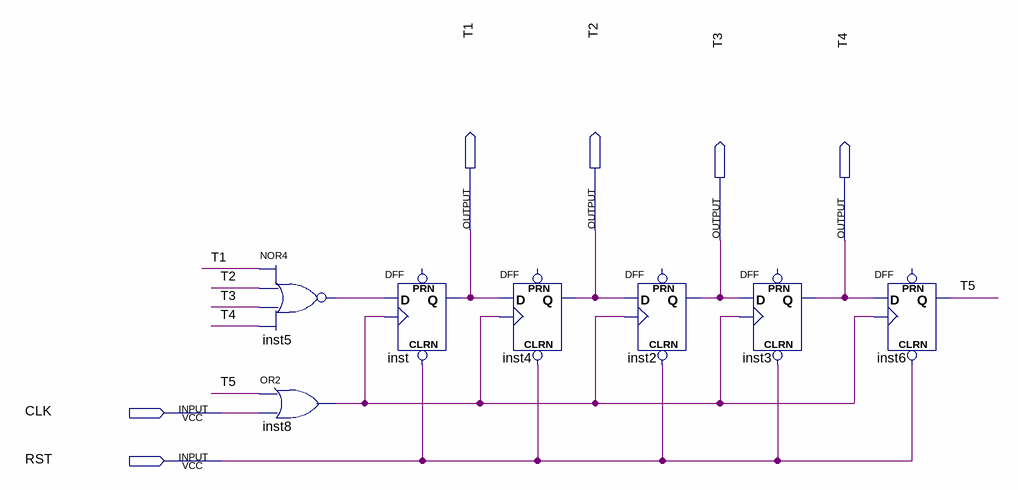
[diagram p0: schematic sheet]
// Quartus schematic FPPG.bdf as structural Verilog: 7 symbols, 6 pins
module FPPG (
  input  CLK,
  input  RST,
  output T1,
  output T2,
  output T3,
  output T4
);

  wire inst5_out, inst8_out, T5;

  nor inst5 (inst5_out, T1, T2, T3, T4);
  or inst8 (inst8_out, T5, CLK);
  DFF inst (.CLRN(RST), .CLK(inst8_out), .D(inst5_out), .Q(T1));  // open: PRN
  DFF inst4 (.CLRN(RST), .CLK(inst8_out), .D(T1), .Q(T2));  // open: PRN
  DFF inst2 (.CLRN(RST), .CLK(inst8_out), .D(T2), .Q(T3));  // open: PRN
  DFF inst3 (.CLRN(RST), .CLK(inst8_out), .D(T3), .Q(T4));  // open: PRN
  DFF inst6 (.CLRN(RST), .CLK(inst8_out), .D(T4), .Q(T5));  // open: PRN
endmodule
